# Altium schematic sheet DRS4.SchDoc: My title
size A3; Organization: University of California; Address1: 475 Portola Plaza; Address2: Los Angeles, CA 90095; DocumentNumber: 21; Revision: R01; SheetNumber: 21; SheetTotal: 35
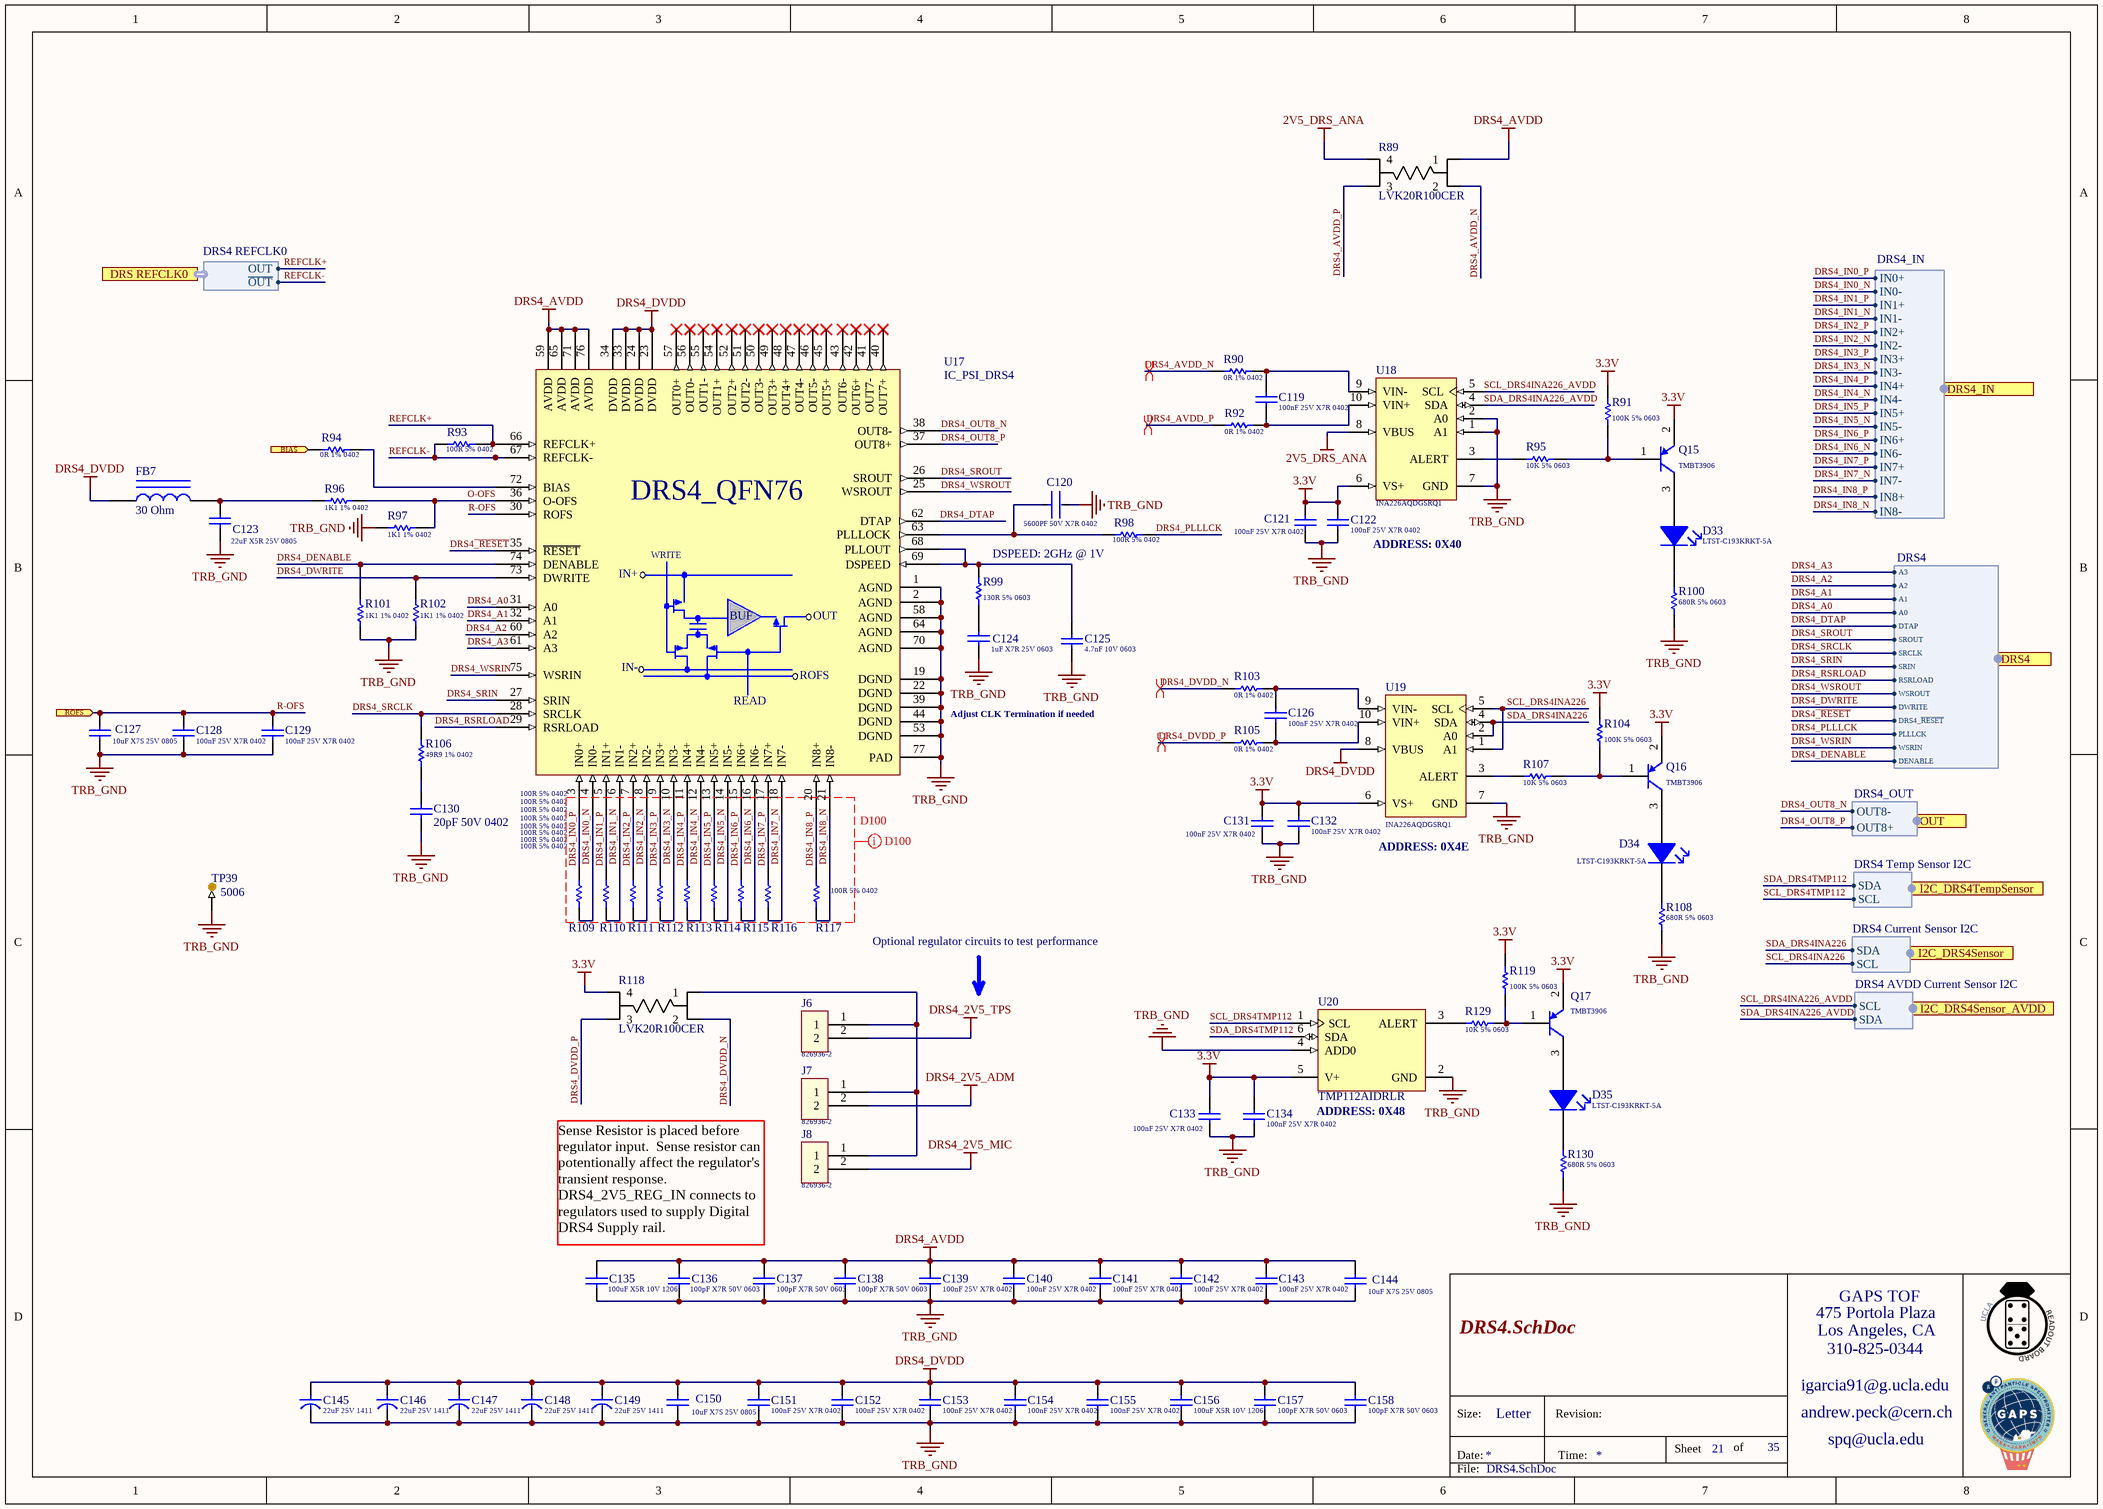
[diagram p0: DRS4.SchDoc]

## Parts
C119  Capacitance: 100nF 25V X7R 0402  [Cap_Taiyo_Yuden_TMK105B7104KV-FR_100nF]  (hidden comment: Cap_Taiyo_Yuden_TMK105B7104KV-FR_100nF)
C120  5600PF 50V X7R 0402  [FP-C0402-BB-MFG]
C121  Capacitance: 100nF 25V X7R 0402  [Cap_Taiyo_Yuden_TMK105B7104KV-FR_100nF]  (hidden comment: Cap_Taiyo_Yuden_TMK105B7104KV-FR_100nF)
C122  Capacitance: 100nF 25V X7R 0402  [Cap_Taiyo_Yuden_TMK105B7104KV-FR_100nF]  (hidden comment: Cap_Taiyo_Yuden_TMK105B7104KV-FR_100nF)
C123  Capacitance: 22uF X5R 25V 0805  [Cap_Murata_GRT21BR61E226ME13L_22uF]  (hidden comment: Cap_Murata_GRT21BR61E226ME13L_22uF)
C124  Capacitance: 1uF X7R 25V 0603  [Cap_Murata_GCJ188R71E105KA01J_1uF]  (hidden comment: Cap_Murata_GCJ188R71E105KA01J_1uF)
C125  4.7nF 10V 0603  [CAPC0603(1608)100_L]
C126  Capacitance: 100nF 25V X7R 0402  [Cap_Taiyo_Yuden_TMK105B7104KV-FR_100nF]  (hidden comment: Cap_Taiyo_Yuden_TMK105B7104KV-FR_100nF)
C127  Capacitance: 10uF X7S 25V 0805  [Cap_Murata_ GRM21BC71E106ME11L_10uF]  (hidden comment: Cap_Murata_ GRM21BC71E106ME11L_10uF)
C128  Capacitance: 100nF 25V X7R 0402  [Cap_Taiyo_Yuden_TMK105B7104KV-FR_100nF]  (hidden comment: Cap_Taiyo_Yuden_TMK105B7104KV-FR_100nF)
C129  Capacitance: 100nF 25V X7R 0402  [Cap_Taiyo_Yuden_TMK105B7104KV-FR_100nF]  (hidden comment: Cap_Taiyo_Yuden_TMK105B7104KV-FR_100nF)
C130  Capacitance: 20pF 50V 0402  [Cap_Murata_GJM1555C1H200GB01D_20pF]  (hidden comment: Cap_Murata_GJM1555C1H200GB01D_20pF)
C131  Capacitance: 100nF 25V X7R 0402  [Cap_Taiyo_Yuden_TMK105B7104KV-FR_100nF]  (hidden comment: Cap_Taiyo_Yuden_TMK105B7104KV-FR_100nF)
C132  Capacitance: 100nF 25V X7R 0402  [Cap_Taiyo_Yuden_TMK105B7104KV-FR_100nF]  (hidden comment: Cap_Taiyo_Yuden_TMK105B7104KV-FR_100nF)
C133  Capacitance: 100nF 25V X7R 0402  [Cap_Taiyo_Yuden_TMK105B7104KV-FR_100nF]  (hidden comment: Cap_Taiyo_Yuden_TMK105B7104KV-FR_100nF)
C134  Capacitance: 100nF 25V X7R 0402  [Cap_Taiyo_Yuden_TMK105B7104KV-FR_100nF]  (hidden comment: Cap_Taiyo_Yuden_TMK105B7104KV-FR_100nF)
C135  Capacitance: 100uF X5R 10V 1206  [Cap_Murata_GRM31CR61A107ME05L_100uF]  (hidden comment: Cap_Murata_GRM31CR61A107ME05L_100uF)
C136  Capacitance: 100pF X7R 50V 0603  [Cap_Kemet_C0603C101J5RACTU_100pF]  (hidden comment: Cap_Kemet_C0603C101J5RACTU_100pF)
C137  Capacitance: 100pF X7R 50V 0603  [Cap_Kemet_C0603C101J5RACTU_100pF]  (hidden comment: Cap_Kemet_C0603C101J5RACTU_100pF)
C138  Capacitance: 100pF X7R 50V 0603  [Cap_Kemet_C0603C101J5RACTU_100pF]  (hidden comment: Cap_Kemet_C0603C101J5RACTU_100pF)
C139  Capacitance: 100nF 25V X7R 0402  [Cap_Taiyo_Yuden_TMK105B7104KV-FR_100nF]  (hidden comment: Cap_Taiyo_Yuden_TMK105B7104KV-FR_100nF)
C140  Capacitance: 100nF 25V X7R 0402  [Cap_Taiyo_Yuden_TMK105B7104KV-FR_100nF]  (hidden comment: Cap_Taiyo_Yuden_TMK105B7104KV-FR_100nF)
C141  Capacitance: 100nF 25V X7R 0402  [Cap_Taiyo_Yuden_TMK105B7104KV-FR_100nF]  (hidden comment: Cap_Taiyo_Yuden_TMK105B7104KV-FR_100nF)
C142  Capacitance: 100nF 25V X7R 0402  [Cap_Taiyo_Yuden_TMK105B7104KV-FR_100nF]  (hidden comment: Cap_Taiyo_Yuden_TMK105B7104KV-FR_100nF)
C143  Capacitance: 100nF 25V X7R 0402  [Cap_Taiyo_Yuden_TMK105B7104KV-FR_100nF]  (hidden comment: Cap_Taiyo_Yuden_TMK105B7104KV-FR_100nF)
C144  Capacitance: 10uF X7S 25V 0805  [Cap_Murata_ GRM21BC71E106ME11L_10uF]  (hidden comment: Cap_Murata_ GRM21BC71E106ME11L_10uF)
C145  Capacitance: 22uF 25V 1411  [Cap_Kemet_T521B226M025ATE100_22uF]  (hidden comment: Cap_Kemet_T521B226M025ATE100_22uF)
C146  Capacitance: 22uF 25V 1411  [Cap_Kemet_T521B226M025ATE100_22uF]  (hidden comment: Cap_Kemet_T521B226M025ATE100_22uF)
C147  Capacitance: 22uF 25V 1411  [Cap_Kemet_T521B226M025ATE100_22uF]  (hidden comment: Cap_Kemet_T521B226M025ATE100_22uF)
C148  Capacitance: 22uF 25V 1411  [Cap_Kemet_T521B226M025ATE100_22uF]  (hidden comment: Cap_Kemet_T521B226M025ATE100_22uF)
C149  Capacitance: 22uF 25V 1411  [Cap_Kemet_T521B226M025ATE100_22uF]  (hidden comment: Cap_Kemet_T521B226M025ATE100_22uF)
C150  Capacitance: 10uF X7S 25V 0805  [Cap_Murata_ GRM21BC71E106ME11L_10uF]  (hidden comment: Cap_Murata_ GRM21BC71E106ME11L_10uF)
C151  Capacitance: 100nF 25V X7R 0402  [Cap_Taiyo_Yuden_TMK105B7104KV-FR_100nF]  (hidden comment: Cap_Taiyo_Yuden_TMK105B7104KV-FR_100nF)
C152  Capacitance: 100nF 25V X7R 0402  [Cap_Taiyo_Yuden_TMK105B7104KV-FR_100nF]  (hidden comment: Cap_Taiyo_Yuden_TMK105B7104KV-FR_100nF)
C153  Capacitance: 100nF 25V X7R 0402  [Cap_Taiyo_Yuden_TMK105B7104KV-FR_100nF]  (hidden comment: Cap_Taiyo_Yuden_TMK105B7104KV-FR_100nF)
C154  Capacitance: 100nF 25V X7R 0402  [Cap_Taiyo_Yuden_TMK105B7104KV-FR_100nF]  (hidden comment: Cap_Taiyo_Yuden_TMK105B7104KV-FR_100nF)
C155  Capacitance: 100nF 25V X7R 0402  [Cap_Taiyo_Yuden_TMK105B7104KV-FR_100nF]  (hidden comment: Cap_Taiyo_Yuden_TMK105B7104KV-FR_100nF)
C156  Capacitance: 100uF X5R 10V 1206  [Cap_Murata_GRM31CR61A107ME05L_100uF]  (hidden comment: Cap_Murata_GRM31CR61A107ME05L_100uF)
C157  Capacitance: 100pF X7R 50V 0603  [Cap_Kemet_C0603C101J5RACTU_100pF]  (hidden comment: Cap_Kemet_C0603C101J5RACTU_100pF)
C158  Capacitance: 100pF X7R 50V 0603  [Cap_Kemet_C0603C101J5RACTU_100pF]  (hidden comment: Cap_Kemet_C0603C101J5RACTU_100pF)
D33  LTST-C193KRKT-5A  [Led_Lite-On_LTST-C193KGKT-5A_Red]
D34  LTST-C193KRKT-5A  [Led_Lite-On_LTST-C193KGKT-5A_Red]
D35  LTST-C193KRKT-5A  [Led_Lite-On_LTST-C193KGKT-5A_Red]
FB7  30 Ohm  [Feb_MURATA_BLM15AX300SZ1D_30]
J6  Series: 826936-2  [Header_TE_Connectivity_826936-2_2POS_5A]  (hidden comment: Header_TE_Connectivity_826936-2_2POS_5A)
J7  Series: 826936-2  [Header_TE_Connectivity_826936-2_2POS_5A]  (hidden comment: Header_TE_Connectivity_826936-2_2POS_5A)
J8  Series: 826936-2  [Header_TE_Connectivity_826936-2_2POS_5A]  (hidden comment: Header_TE_Connectivity_826936-2_2POS_5A)
Q15  Series: TMBT3906  [BJT_PNP_Toshiba_TMBT3906]  (hidden comment: BJT_PNP_Toshiba_TMBT3906)
Q16  Series: TMBT3906  [BJT_PNP_Toshiba_TMBT3906]  (hidden comment: BJT_PNP_Toshiba_TMBT3906)
Q17  Series: TMBT3906  [BJT_PNP_Toshiba_TMBT3906]  (hidden comment: BJT_PNP_Toshiba_TMBT3906)
R89  LVK20R100CER  [OH_LVK20_OHM]
R90  Resistance: 0R 1% 0402  [Res_Vishay_CRCW04020000Z0EDC_0_Ohm]  (hidden comment: Res_Vishay_CRCW04020000Z0EDC_0_Ohm)
R91  100K 5% 0603  [RESC0603(1608)_N]
R92  Resistance: 0R 1% 0402  [Res_Vishay_CRCW04020000Z0EDC_0_Ohm]  (hidden comment: Res_Vishay_CRCW04020000Z0EDC_0_Ohm)
R93  100R 5% 0402  [RESC0402(1005)_L]
R94  Resistance: 0R 1% 0402  [Res_Vishay_CRCW04020000Z0EDC_0_Ohm]  (hidden comment: Res_Vishay_CRCW04020000Z0EDC_0_Ohm)
R95  10K 5% 0603  [RESC0603(1608)_L]
R96  1K1 1% 0402  [RESC0402(1005)_L]
R97  1K1 1% 0402  [RESC0402(1005)_L]
R98  100R 5% 0402  [RESC0402(1005)_L]
R99  130R 5% 0603  [RESC0603(1608)_L]
R100  680R 5% 0603  [RESC0603(1608)_L]
R101  1K1 1% 0402  [RESC0402(1005)_L]
R102  1K1 1% 0402  [RESC0402(1005)_L]
R103  Resistance: 0R 1% 0402  [Res_Vishay_CRCW04020000Z0EDC_0_Ohm]  (hidden comment: Res_Vishay_CRCW04020000Z0EDC_0_Ohm)
R104  100K 5% 0603  [RESC0603(1608)_N]
R105  Resistance: 0R 1% 0402  [Res_Vishay_CRCW04020000Z0EDC_0_Ohm]  (hidden comment: Res_Vishay_CRCW04020000Z0EDC_0_Ohm)
R106  49R9 1% 0402  [RESC0402(1005)_L]
R107  10K 5% 0603  [RESC0603(1608)_L]
R108  680R 5% 0603  [RESC0603(1608)_L]
R109  100R 5% 0402  [RESC0402(1005)_L]
R110  100R 5% 0402  [RESC0402(1005)_L]
R111  100R 5% 0402  [RESC0402(1005)_L]
R112  100R 5% 0402  [RESC0402(1005)_L]
R113  100R 5% 0402  [RESC0402(1005)_L]
R114  100R 5% 0402  [RESC0402(1005)_L]
R115  100R 5% 0402  [RESC0402(1005)_L]
R116  100R 5% 0402  [RESC0402(1005)_L]
R117  100R 5% 0402  [RESC0402(1005)_L]
R118  LVK20R100CER  [OH_LVK20_OHM]
R119  100K 5% 0603  [RESC0603(1608)_N]
R129  10K 5% 0603  [RESC0603(1608)_L]
R130  680R 5% 0603  [RESC0603(1608)_L]
TP39  Series: 5006  [TP_Keystone_Electronics_5006]  (hidden comment: TP_Keystone_Electronics_5006)
U17  IC_PSI_DRS4  [DRS4]
U18  INA226AQDGSRQ1  [INA226AQDGSRQ1]
U19  INA226AQDGSRQ1  [INA226AQDGSRQ1]
U20  TMP112AIDRLR  [TMP112AIDRLR]

## Ports
BIAS (in), DRS4 (harness DRS4), DRS4_IN (harness DRS4_IN), DRS REFCLK0 (harness DRS4 REFCLK0), I2C_DRS4Sensor (harness DRS4 Current Sensor I2C), I2C_DRS4Sensor_AVDD (harness DRS4 AVDD Current Sensor I2C), I2C_DRS4TempSensor (harness DRS4 Temp Sensor I2C), OUT (harness DRS4_OUT), ROFS (in)

## Harnesses
DRS4: A3, A2, A1, A0, DTAP, SROUT, SRCLK, SRIN, RSRLOAD, WSROUT, DWRITE, DRS4_~{RESET}, PLLLCK, WSRIN, DENABLE
DRS4_IN: IN0+, IN0-, IN1+, IN1-, IN2+, IN2-, IN3+, IN3-, IN4+, IN4-, IN5+, IN5-, IN6+, IN6-, IN7+, IN7-, IN8+, IN8-
DRS4_OUT: OUT8+, OUT8-
DRS4 REFCLK0: OUT, ~{OUT}
DRS4 Temp Sensor I2C: SCL, SDA
DRS4 Current Sensor I2C: SCL, SDA
DRS4 AVDD Current Sensor I2C: SCL, SDA

## Nets
2V5_DRS_ANA: R89.4 U18.8(VBUS)
3.3V: C121.2 C122.2 C131.2 C132.2 C133.2 C134.2 Q15.2(E) Q16.2(E) Q17.2(E) R91.2 R104.2 R118.4 R119.2 U18.6(VS+) U19.6(VS+) U20.5(V+)
DRS4_2V5_ADM: J7.2
DRS4_2V5_MIC: J8.2
DRS4_2V5_TPS: J6.2
DRS4_AVDD: C135.2 C136.1 C137.1 C138.1 C139.2 C140.2 C141.2 C142.2 C143.2 C144.1 R89.1 U17.59(AVDD) U17.65(AVDD) U17.71(AVDD) U17.76(AVDD)
DRS4_DVDD: C145.1 C146.1 C147.1 C148.1 C149.1 C150.1 C151.2 C152.2 C153.2 C154.2 C155.2 C156.2 C157.1 C158.1 FB7.1 U17.23(DVDD) U17.24(DVDD) U17.33(DVDD) U17.34(DVDD) U19.8(VBUS)
TRB_GND: C120.2 C121.1 C122.1 C123.1 C124.1 C125.1 C127.2 C128.1 C129.1 C130.1 C131.1 C132.1 C133.1 C134.1 C135.1 C136.2 C137.2 C138.2 C139.1 C140.1 C141.1 C142.1 C143.1 C144.2 C145.2 C146.2 C147.2 C148.2 C149.2 C150.2 C151.1 C152.1 C153.1 C154.1 C155.1 C156.1 C157.2 C158.2 R97.2 R100.1 R101.1 R102.1 R108.1 R130.1 TP39.1 U17.1(AGND) U17.2(AGND) U17.19(DGND) U17.22(DGND) U17.39(DGND) U17.44(DGND) U17.53(DGND) U17.58(AGND) U17.64(AGND) U17.70(AGND) U17.77(PAD) U18.1(A1) U18.2(A0) U18.7(GND) U19.7(GND) U20.2(GND) U20.4(ADD0)
BIAS: R94.1 ; port BIAS
DRS4~{_RESET}: U17.35(~{RESET}) ; port DRS4.DRS4_~{RESET}
DRS4_A0: U17.31(A0) ; port DRS4.A0
DRS4_A1: U17.32(A1) ; port DRS4.A1
DRS4_A2: U17.60(A2) ; port DRS4.A2
DRS4_A3: U17.61(A3) ; port DRS4.A3
DRS4_AVDD_N: R89.2 R90.1
DRS4_AVDD_P: R89.3 R92.1
DRS4_DENABLE: R101.2 U17.74(DENABLE) ; port DRS4.DENABLE
DRS4_DTAP: U17.62(DTAP) ; port DRS4.DTAP
DRS4_DVDD_N: R103.1 R118.2
DRS4_DVDD_P: R105.1 R118.3
DRS4_DWRITE: R102.2 U17.73(DWRITE) ; port DRS4.DWRITE
DRS4_IN0_N: R109.2 U17.4(IN0-) ; port DRS4_IN.IN0-
DRS4_IN0_P: R109.1 U17.3(IN0+) ; port DRS4_IN.IN0+
DRS4_IN1_N: R110.2 U17.6(IN1-) ; port DRS4_IN.IN1-
DRS4_IN1_P: R110.1 U17.5(IN1+) ; port DRS4_IN.IN1+
DRS4_IN2_N: R111.2 U17.8(IN2-) ; port DRS4_IN.IN2-
DRS4_IN2_P: R111.1 U17.7(IN2+) ; port DRS4_IN.IN2+
DRS4_IN3_N: R112.2 U17.10(IN3-) ; port DRS4_IN.IN3-
DRS4_IN3_P: R112.1 U17.9(IN3+) ; port DRS4_IN.IN3+
DRS4_IN4_N: R113.2 U17.12(IN4-) ; port DRS4_IN.IN4-
DRS4_IN4_P: R113.1 U17.11(IN4+) ; port DRS4_IN.IN4+
DRS4_IN5_N: R114.2 U17.14(IN5-) ; port DRS4_IN.IN5-
DRS4_IN5_P: R114.1 U17.13(IN5+) ; port DRS4_IN.IN5+
DRS4_IN6_N: R115.2 U17.16(IN6-) ; port DRS4_IN.IN6-
DRS4_IN6_P: R115.1 U17.15(IN6+) ; port DRS4_IN.IN6+
DRS4_IN7_N: R116.2 U17.18(IN7-) ; port DRS4_IN.IN7-
DRS4_IN7_P: R116.1 U17.17(IN7+) ; port DRS4_IN.IN7+
DRS4_IN8_N: R117.2 U17.21(IN8-) ; port DRS4_IN.IN8-
DRS4_IN8_P: R117.1 U17.20(IN8+) ; port DRS4_IN.IN8+
DRS4_OUT8_N: U17.38(OUT8-) ; port OUT.OUT8-
DRS4_OUT8_P: U17.37(OUT8+) ; port OUT.OUT8+
DRS4_PLLLCK: R98.1 ; port DRS4.PLLLCK
DRS4_RSRLOAD: U17.29(RSRLOAD) ; port DRS4.RSRLOAD
DRS4_SRCLK: R106.1 U17.28(SRCLK) ; port DRS4.SRCLK
DRS4_SRIN: U17.27(SRIN) ; port DRS4.SRIN
DRS4_SROUT: U17.26(SROUT) ; port DRS4.SROUT
DRS4_WSRIN: U17.75(WSRIN) ; port DRS4.WSRIN
DRS4_WSROUT: U17.25(WSROUT) ; port DRS4.WSROUT
O-OFS: R96.1 R97.1 U17.36(O-OFS)
R-OFS: C127.1 C128.2 C129.2 U17.30(ROFS) ; port ROFS
REFCLK+: R93.1 U17.66(REFCLK+) ; port DRS REFCLK0.OUT
REFCLK-: R93.2 U17.67(REFCLK-) ; port DRS REFCLK0.~{OUT}
SCL_DRS4INA226: U19.1(A1) U19.5(SCL) ; port I2C_DRS4Sensor.SCL
SCL_DRS4INA226_AVDD: U18.5(SCL) ; port I2C_DRS4Sensor_AVDD.SCL
SCL_DRS4TMP112: U20.1(SCL) ; port I2C_DRS4TempSensor.SCL
SDA_DRS4INA226: U19.2(A0) U19.4(SDA) ; port I2C_DRS4Sensor.SDA
SDA_DRS4INA226_AVDD: U18.4(SDA) ; port I2C_DRS4Sensor_AVDD.SDA
SDA_DRS4TMP112: U20.6(SDA) ; port I2C_DRS4TempSensor.SDA
NetC119_1: C119.1 R92.2 U18.10(VIN+)
NetC119_2: C119.2 R90.2 U18.9(VIN-)
NetC120_1: C120.1 R98.2 U17.63(PLLLOCK)
NetC123_2: C123.2 FB7.2 R96.2
NetC124_2: C124.2 R99.1
NetC125_2: C125.2 R99.2 U17.68(PLLOUT) U17.69(DSPEED)
NetC126_1: C126.1 R105.2 U19.10(VIN+)
NetC126_2: C126.2 R103.2 U19.9(VIN-)
NetC130_2: C130.2 R106.2
NetD33_1: D33.1(K) R100.2
NetD33_2: D33.2(A) Q15.3(C)
NetD34_1: D34.1(K) R108.2
NetD34_2: D34.2(A) Q16.3(C)
NetD35_1: D35.1(K) R130.2
NetD35_2: D35.2(A) Q17.3(C)
NetJ6_1: J6.1 J7.1 J8.1 R118.1
NetQ15_1: Q15.1(B) R91.1 R95.1
NetQ16_1: Q16.1(B) R104.1 R107.1
NetQ17_1: Q17.1(B) R119.1 R129.1
NetR94_2: R94.2 U17.72(BIAS)
NetR95_2: R95.2 U18.3(ALERT)
NetR107_2: R107.2 U19.3(ALERT)
NetR129_2: R129.2 U20.3(ALERT)

Not connected (* = marked no-connect by the designer): U17 40(OUT7+)* 41(OUT7-)* 42(OUT6+)* 43(OUT6-)* 45(OUT5+)* 46(OUT5-)* 47(OUT4-)* 48(OUT4+)* 49(OUT3+)* 50(OUT3-)* 51(OUT2-)* 52(OUT2+)* 54(OUT1+)* 55(OUT1-)* 56(OUT0-)* 57(OUT0+)*

## Layout directives
differential pair; differential pair class D100: DRS4_IN0_N, DRS4_IN0_P, DRS4_IN1_N, DRS4_IN1_P, DRS4_IN2_N, DRS4_IN2_P, DRS4_IN3_N, DRS4_IN3_P, DRS4_IN4_N, DRS4_IN4_P, DRS4_IN5_N, DRS4_IN5_P, DRS4_IN6_N, DRS4_IN6_P, DRS4_IN7_N, DRS4_IN7_P, DRS4_IN8_N, DRS4_IN8_P
differential pair: DRS4_AVDD_N, DRS4_AVDD_P, DRS4_DVDD_N, DRS4_DVDD_P

## Notes on the sheet
- DSPEED: 2GHz @ 1V
- ADDRESS: 0X40
- Adjust CLK Termination if needed
- (near U17) D100
- (near U19) ADDRESS: 0X4E
- Optional regulator circuits to test performance
- (near U20) ADDRESS: 0X48
- Sense Resistor is placed before regulator input.  Sense resistor can potentionally affect the regulator's transient response. DRS4_2V5_REG_IN connects to regulators used to supply Digital DRS4 Supply rail.
- 475 Portola Plaza
- GAPS TOF
- igarcia91@g.ucla.edu
- Los Angeles, CA
- 310-825-0344
- Size:
- Date:
- Letter
- Revision:
- Time:
- Sheet
- of
- andrew.peck@cern.ch
- spq@ucla.edu
- File:
- (in symbol DRS4) DRS4_QFN76; WRITE; IN+; BUF; OUT; IN-; READ

## Library data of the parts
C119 C121 C122 C126 C128 C129 C131-C134 C139-C143 C151-C155 = Cap_Taiyo_Yuden_TMK105B7104KV-FR_100nF: CAP CER 100nF 25V X7R 0402; Supplier 1: Mouser; Supplier Part Number 1: 963-TMK105B7104KV-FR
C120 = CMP-03020-007524-1: CAP CER 5600PF 50V X7R 0402 / C0402C562K5RACTU; Manufacturer: Kemet; Temperature Coefficient: 15%; Tolerance: 0.1; Material: Ceramic; Value: 5,600 pF; Temperature Characteristic: X7R; Device Class L3: Ceramic Capacitors; Height: 0.55mm; Temperature: -55°C to +125°C; Package: C0402-BB; Category: Cap; ComponentLink2Description: Datasheet; Device Class L2: Capacitors; Automotive: No; Device Class L1: Passive Components; Lead Free: Yes; ComponentLink2URL: https://content.kemet.com/datasheets/KEM_C1002_X7R_SMD.pdf; Digikey Description: CAP CER 5600PF 50V X7R 0402; Temperature Range High: +125°C; RoHS: TRUE; Octopart: https://octopart.com/c0402c562k5ractu-kemet-98458; Temperature Range Low: -55°C; Ipc Land Pattern Name: CAPC10050X50; Voltage Rating: 50 V; Mouser Description: Multilayer Ceramic Capacitors MLCC - SMD/SMT 50volts 5600pF X7R 10%; Manufacturer Part Number: C0402C562K5RACTU; Capacitance: 5,600 pF
C123 = Cap_Murata_GRT21BR61E226ME13L_22uF: CAP CER 22uF 25V X5R 0805; Supplier 1: Mouser; Supplier Part Number 1: 81-GRT21BR61E226ME3L
C124 = Cap_Murata_GCJ188R71E105KA01J_1uF: CAP CER 1uF 25V X7R 0603; Supplier 1: Mouser; Supplier Part Number 1: 81-GCJ188R71E105KA1J
C125 = CMP-1035-02189-1: CAP 4.7nF 10V ±10% 0603 (1608 Metric) Thickness 1mm SMD; Case-Metric: 1608; Tolerance: Â±10%; Case-EIA: 0603; Max Thickness: 1 mm; Technology: SMT; Rated Voltage: 10 V; Value: 4.7nF
C127 C144 C150 = Cap_Murata_ GRM21BC71E106ME11L_10uF: CAP CER 10uF 25V X7R 0805; Supplier 1: Mouser; Supplier Part Number 1: 81-GRM21BC71E106ME1L
C130 = Cap_Murata_GJM1555C1H200GB01D_20pF: Multilayer Ceramic Capacitors MLCC - SMD/SMT 0402 20pF 50Volts C0G 2%; Supplier 1: Mouser; Supplier Part Number 1: 81-GJM1555C1H200GB01
C135 C156 = Cap_Murata_GRM31CR61A107ME05L_100uF: CAP CER 100uF 25V X5R 1206; Supplier Part Number 1: 81-GRM31CR61A107ME5L; Supplier 1: Mouser
C136-C138 C157 C158 = Cap_Kemet_C0603C101J5RACTU_100pF: CAP CER 100pF 50V X7R 0603; Supplier 1: Mouser; Supplier Part Number 1: 80-C0603C101J5R
C145-C149 = Cap_Kemet_T521B226M025ATE100_22uF: Tantalum Capacitors - Polymer SMD 25V 22uF 1311 20% ESR=100mOhms; Supplier Part Number 1: 80-T521B226M25ATE100; Supplier 1: Mouser
D33-D35 = Led_Lite-On_LTST-C193KGKT-5A_Red: Standard LEDs - SMD Red 470nm 28mcd 20mA; Supplier 1: Mouser; Supplier Part Number 1: 859-LTSTC193KRKT5A; Series: LTST-C193KRKT-5A
FB7 = Feb_MURATA_BLM15AX300SZ1D_30: Feb SMD 30 OHM 25% 3/4W 0402; Supplier 1: Mouser; Supplier Part Number 1: 81-BLM15AX300SZ1D
J6-J8 = Header_TE_Connectivity_826936-2_2POS_5A: Headers & Wire Housings 2P SINGLE ROW 5A; Supplier Part Number 1: 571-826936-2; Supplier 1: Mouser
Q15-Q17 = BJT_PNP_Toshiba_TMBT3906: Bipolar Transistors - BJT Transistor for Low Freq. Amplification; Manufacturer Part Number 1: TMBT3906,LM; Supplier 1: Mouser; Supplier Part Number 1: 757-TMBT3906LM; Manufacturer: Toshiba
R89 R118 = LVK20R100CER: Current Sense Resistors - SMD .1 OHM.25% 3/4W; Vendor: Ohmite; Built_By: EMA_UL_Team; SourceLibrary: Ohmite_2014-12-31; Manufacturer_Part_Number: LVK20R100CER; Copyright: Copyright (C) 2018 Accelerated Designs. All rights reserved; RefDes: RefDes; Type: DEV
R90 R92 R94 R103 R105 = Res_Vishay_CRCW04020000Z0EDC_0_Ohm: 0R 0.062W 1% 0402 (1005 Metric)  SMD; Supplier 1: Mouser; Supplier Part Number 1: 71-CRCW04020000Z0EDC
R91 R104 R119 = CMP-1012-00122-1: 100K 0.1W 5% 0603 (1608 Metric)  SMD; Case-EIA: 0603; Value: 100000.00 Ohm; Case-Metric: 1608; Tolerance: 5 %; Power: 0.1 W; Technology: SMT
R93 R98 R109-R117 = CMP-1011-00050-1: 100R 0.063W 5% 0402 (1005 Metric)  SMD; Case-EIA: 0402; Value: 100.00 Ohm; Case-Metric: 1005; Tolerance: 5 %; Technology: SMT; Power: 0.063 W
R95 R107 R129 = CMP-1012-00098-1: 10K 0.1W 5% 0603 (1608 Metric)  SMD; Case-EIA: 0603; Value: 10000.00 Ohm; Case-Metric: 1608; Technology: SMT; Tolerance: 5 %; Power: 0.1 W
R96 R97 R101 R102 = CMP-1011-00514-1: 1K1 0.063W 1% 0402 (1005 Metric)  SMD; Case-Metric: 1005; Case-EIA: 0402; Value: 1100.00 Ohm; Power: 0.063 W; Tolerance: 1 %; Technology: SMT
R99 = CMP-1012-00053-1: 130R 0.1W 5% 0603 (1608 Metric)  SMD; Case-Metric: 1608; Case-EIA: 0603; Value: 130.00 Ohm; Technology: SMT; Tolerance: 5 %; Power: 0.1 W
R100 R108 R130 = CMP-1012-00070-1: 680R 0.1W 5% 0603 (1608 Metric)  SMD; Case-EIA: 0603; Value: 680.00 Ohm; Case-Metric: 1608; Tolerance: 5 %; Technology: SMT; Power: 0.1 W
R106 = CMP-1011-00363-1: 49R9 0.063W 1% 0402 (1005 Metric)  SMD; Case-EIA: 0402; Case-Metric: 1005; Value: 49.90 Ohm; Power: 0.063 W; Technology: SMT; Tolerance: 1 %
TP39 = TP_Keystone_Electronics_5006: Circuit Board Hardware - PCB TEST POINT BLK .063; Supplier 1: Mouser; Supplier Part Number 1: 534-5006
U17 = DRS4: DRS4 QFN76 DAQ Chip; Series: DRS4
U18 U19 = INA226AQDGSRQ1: Current & Power Monitors & Regulators Automotive, 36-V, Ultra-High Accuracy, Low-/High-Side, I2C Out Current/Power Monitor w/ Alert 10-VSSOP -40 to 125; Supplier 1: Mouser; Supplier Part Number 1: 595-INA226AQDGSRQ1
U20 = TMP112AIDRLR: Board Mount Temperature Sensors Hi-Prec Lo-Pwr Dig Temp Sensor; Supplier 1: Mouser; Supplier Part Number 1: 595-TMP112AIDRLR